# Altium schematic sheet VFDDrive.SchDoc
size A4
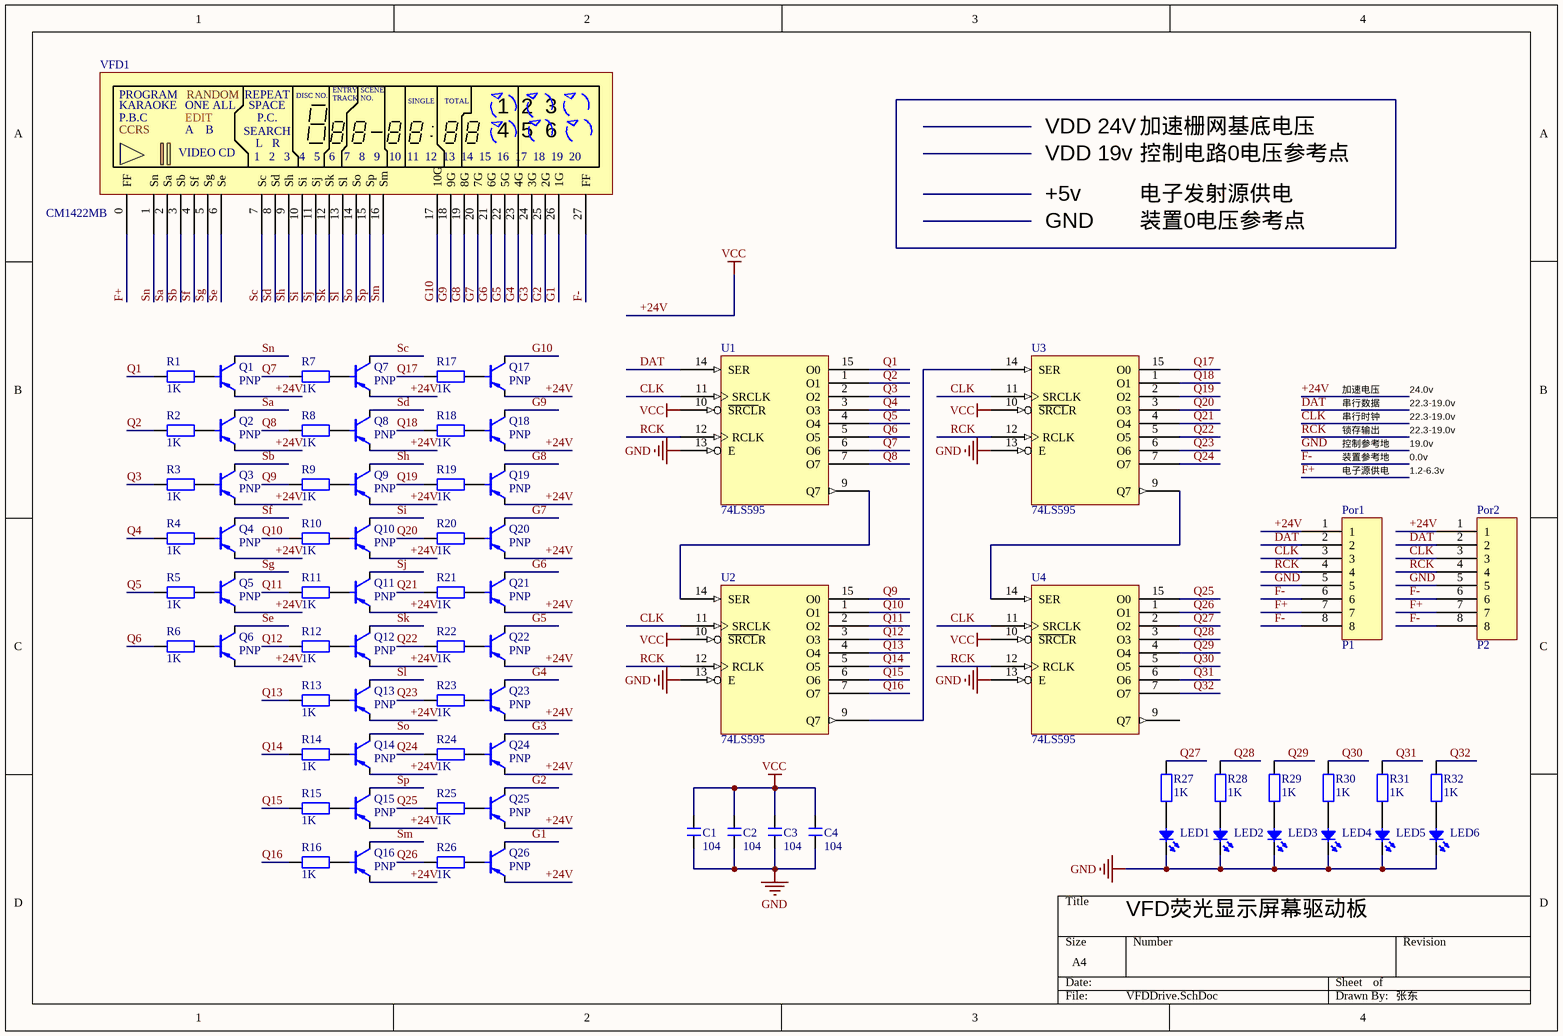
[diagram p0: VFDDrive.SchDoc]

## Parts
C1  104  [C 0805]
C2  104  [C 0805]
C3  104  [C 0805]
C4  104  [C 0805]
LED1  LED  [0805D]  (value not drawn)
LED2  LED  [0805D]  (value not drawn)
LED3  LED  [0805D]  (value not drawn)
LED4  LED  [0805D]  (value not drawn)
LED5  LED  [0805D]  (value not drawn)
LED6  LED  [0805D]  (value not drawn)
Por1  P1  [FP8]
Por2  P2  [FP8]
Q1  PNP  [SOT-23]
Q2  PNP  [SOT-23]
Q3  PNP  [SOT-23]
Q4  PNP  [SOT-23]
Q5  PNP  [SOT-23]
Q6  PNP  [SOT-23]
Q7  PNP  [SOT-23]
Q8  PNP  [SOT-23]
Q9  PNP  [SOT-23]
Q10  PNP  [SOT-23]
Q11  PNP  [SOT-23]
Q12  PNP  [SOT-23]
Q13  PNP  [SOT-23]
Q14  PNP  [SOT-23]
Q15  PNP  [SOT-23]
Q16  PNP  [SOT-23]
Q17  PNP  [SOT-23]
Q18  PNP  [SOT-23]
Q19  PNP  [SOT-23]
Q20  PNP  [SOT-23]
Q21  PNP  [SOT-23]
Q22  PNP  [SOT-23]
Q23  PNP  [SOT-23]
Q24  PNP  [SOT-23]
Q25  PNP  [SOT-23]
Q26  PNP  [SOT-23]
R1  1K  [R 0805]
R2  1K  [R 0805]
R3  1K  [R 0805]
R4  1K  [R 0805]
R5  1K  [R 0805]
R6  1K  [R 0805]
R7  1K  [R 0805]
R8  1K  [R 0805]
R9  1K  [R 0805]
R10  1K  [R 0805]
R11  1K  [R 0805]
R12  1K  [R 0805]
R13  1K  [R 0805]
R14  1K  [R 0805]
R15  1K  [R 0805]
R16  1K  [R 0805]
R17  1K  [R 0805]
R18  1K  [R 0805]
R19  1K  [R 0805]
R20  1K  [R 0805]
R21  1K  [R 0805]
R22  1K  [R 0805]
R23  1K  [R 0805]
R24  1K  [R 0805]
R25  1K  [R 0805]
R26  1K  [R 0805]
R27  1K  [R 0805]
R28  1K  [R 0805]
R29  1K  [R 0805]
R30  1K  [R 0805]
R31  1K  [R 0805]
R32  1K  [R 0805]
U1  74LS595  [SOP-16]
U2  74LS595  [SOP-16]
U3  74LS595  [SOP-16]
U4  74LS595  [SOP-16]
VFD1  CM1422MB  [VFD2.5]

## Nets
+24V: C1.2 C2.2 C3.2 C4.2 Por1.1 Por2.1 Q1.2(e) Q2.2(e) Q3.2(e) Q4.2(e) Q5.2(e) Q6.2(e) Q7.2(e) Q8.2(e) Q9.2(e) Q10.2(e) Q11.2(e) Q12.2(e) Q13.2(e) Q14.2(e) Q15.2(e) Q16.2(e) Q17.2(e) Q18.2(e) Q19.2(e) Q20.2(e) Q21.2(e) Q22.2(e) Q23.2(e) Q24.2(e) Q25.2(e) Q26.2(e) U1.10(~{SRCL}R) U1.16(VCC) U2.10(~{SRCL}R) U2.16(VCC) U3.10(~{SRCL}R) U3.16(VCC) U4.10(~{SRCL}R) U4.16(VCC)  [also labelled VCC]
GND: C1.1 C2.1 C3.1 C4.1 LED1.2(K) LED2.2(K) LED3.2(K) LED4.2(K) LED5.2(K) LED6.2(K) Por1.5 Por2.5 U1.8(GND) U1.13(E) U2.8(GND) U2.13(E) U3.8(GND) U3.13(E) U4.8(GND) U4.13(E)
CLK: Por1.3 Por2.3 U1.11(SRCLK) U2.11(SRCLK) U3.11(SRCLK) U4.11(SRCLK)
DAT: Por1.2 Por2.2 U1.14(SER)
F+: Por1.7 Por2.7 VFD1.0(FF)
F-: Por1.6 Por1.8 Por2.6 Por2.8 VFD1.27(FF)
G1: Q26.1(c) VFD1.26(1G)
G2: Q25.1(c) VFD1.25(2G)
G3: Q24.1(c) VFD1.24(3G)
G4: Q23.1(c) VFD1.23(4G)
G5: Q22.1(c) VFD1.22(5G)
G6: Q21.1(c) VFD1.21(6G)
G7: Q20.1(c) VFD1.20(7G)
G8: Q19.1(c) VFD1.19(8G)
G9: Q18.1(c) VFD1.18(9G)
G10: Q17.1(c) VFD1.17(10G)
Q1: R1.1 U1.15(O0)
Q2: R2.1 U1.1(O1)
Q3: R3.2 U1.2(O2)
Q4: R4.2 U1.3(O3)
Q5: R5.2 U1.4(O4)
Q6: R6.2 U1.5(O5)
Q7: R7.2 U1.6(O6)
Q8: R8.2 U1.7(O7)
Q9: R9.2 U2.15(O0)
Q10: R10.2 U2.1(O1)
Q11: R11.2 U2.2(O2)
Q12: R12.2 U2.3(O3)
Q13: R13.2 U2.4(O4)
Q14: R14.2 U2.5(O5)
Q15: R15.2 U2.6(O6)
Q16: R16.2 U2.7(O7)
Q17: R17.2 U3.15(O0)
Q18: R18.2 U3.1(O1)
Q19: R19.2 U3.2(O2)
Q20: R20.2 U3.3(O3)
Q21: R21.2 U3.4(O4)
Q22: R22.2 U3.5(O5)
Q23: R23.2 U3.6(O6)
Q24: R24.2 U3.7(O7)
Q25: R25.2 U4.15(O0)
Q26: R26.2 U4.1(O1)
Q27: R27.2 U4.2(O2)
Q28: R28.2 U4.3(O3)
Q29: R29.2 U4.4(O4)
Q30: R30.2 U4.5(O5)
Q31: R31.2 U4.6(O6)
Q32: R32.2 U4.7(O7)
RCK: Por1.4 Por2.4 U1.12(RCLK) U2.12(RCLK) U3.12(RCLK) U4.12(RCLK)
Sa: Q2.1(c) VFD1.2(Sa)
Sb: Q3.1(c) VFD1.3(Sb)
Sc: Q7.1(c) VFD1.7(Sc)
Sd: Q8.1(c) VFD1.8(Sd)
Se: Q6.1(c) VFD1.6(Se)
Sf: Q4.1(c) VFD1.4(Sf)
Sg: Q5.1(c) VFD1.5(Sg)
Sh: Q9.1(c) VFD1.9(Sh)
Si: Q10.1(c) VFD1.10(Si)
Sj: Q11.1(c) VFD1.11(Sj)
Sk: Q12.1(c) VFD1.12(Sk)
Sl: Q13.1(c) VFD1.13(Sl)
Sm: Q16.1(c) VFD1.16(Sm)
Sn: Q1.1(c) VFD1.1(Sn)
So: Q14.1(c) VFD1.14(So)
Sp: Q15.1(c) VFD1.15(Sp)
NetLED1_1: LED1.1(A) R27.1
NetLED2_1: LED2.1(A) R28.1
NetLED3_1: LED3.1(A) R29.1
NetLED4_1: LED4.1(A) R30.1
NetLED5_1: LED5.1(A) R31.1
NetLED6_1: LED6.1(A) R32.1
NetQ1_3: Q1.3(b) R1.2
NetQ2_3: Q2.3(b) R2.2
NetQ3_3: Q3.3(b) R3.1
NetQ4_3: Q4.3(b) R4.1
NetQ5_3: Q5.3(b) R5.1
NetQ6_3: Q6.3(b) R6.1
NetQ7_3: Q7.3(b) R7.1
NetQ8_3: Q8.3(b) R8.1
NetQ9_3: Q9.3(b) R9.1
NetQ10_3: Q10.3(b) R10.1
NetQ11_3: Q11.3(b) R11.1
NetQ12_3: Q12.3(b) R12.1
NetQ13_3: Q13.3(b) R13.1
NetQ14_3: Q14.3(b) R14.1
NetQ15_3: Q15.3(b) R15.1
NetQ16_3: Q16.3(b) R16.1
NetQ17_3: Q17.3(b) R17.1
NetQ18_3: Q18.3(b) R18.1
NetQ19_3: Q19.3(b) R19.1
NetQ20_3: Q20.3(b) R20.1
NetQ21_3: Q21.3(b) R21.1
NetQ22_3: Q22.3(b) R22.1
NetQ23_3: Q23.3(b) R23.1
NetQ24_3: Q24.3(b) R24.1
NetQ25_3: Q25.3(b) R25.1
NetQ26_3: Q26.3(b) R26.1
NetU1_9: U1.9(Q7) U2.14(SER)
NetU2_9: U2.9(Q7) U3.14(SER)
NetU3_9: U3.9(Q7) U4.14(SER)

Not connected (* = marked no-connect by the designer): U4 9(Q7)

## Notes on the sheet
- VDD 19v
- VDD 24V
- 控制电路0电压参考点
- 加速栅网基底电压
- GND
- +5v
- 电子发射源供电
- 装置0电压参考点
- 加速电压
- 串行数据
- 串行时钟
- 锁存输出
- 控制参考地
- 24.0v
- 22.3-19.0v
- 19.0v
- 装置参考地
- 电子源供电
- 0.0v
- 1.2-6.3v
- VFD荧光显示屏幕驱动板
- 张东
- (in symbol CM1422MB) ENTRY; SCENE; PROGRAM; RANDOM; REPEAT; DISC NO.; TRACK; NO.; SINGLE; TOTAL; KARAOKE; ONE ALL; SPACE; 1  2  3; P.B.C; EDIT; P.C.; CCRS; A    B; SEARCH; 4  5  6; L   R; VIDEO CD; 1   2   3   4   5   6   7   8   9   10  11  12  13  14  15  16  17  18  19  20

## Library data of the parts
C1-C4 = C: 无极性贴片电容; 版权归属: 源创客; BOM名称: 无极性贴片电容; 学习资源: www.ooocke.com
Por1 Por2 = Header
R1-R32 = R: 贴片电阻; 版权归属: 源创客; BOM名称: 贴片电阻; 学习资源: www.ooocke.com
LED1-LED6 = LED: Published: 8-Jun-2000; LatestRevisionDate: 08-Jul-2005; LatestRevisionNote: Mech Layer 1 removed.; PackageReference: LED-0; Publisher: Altium Limited; PackageDescription: LED; 2 Leads